# EasyEDA schematic 6coils-blue-v4.json
TITLE: Sheet_1; REV: 1.0; Date: 2024-01-02; Sheet: 1/1; Company: Your Company
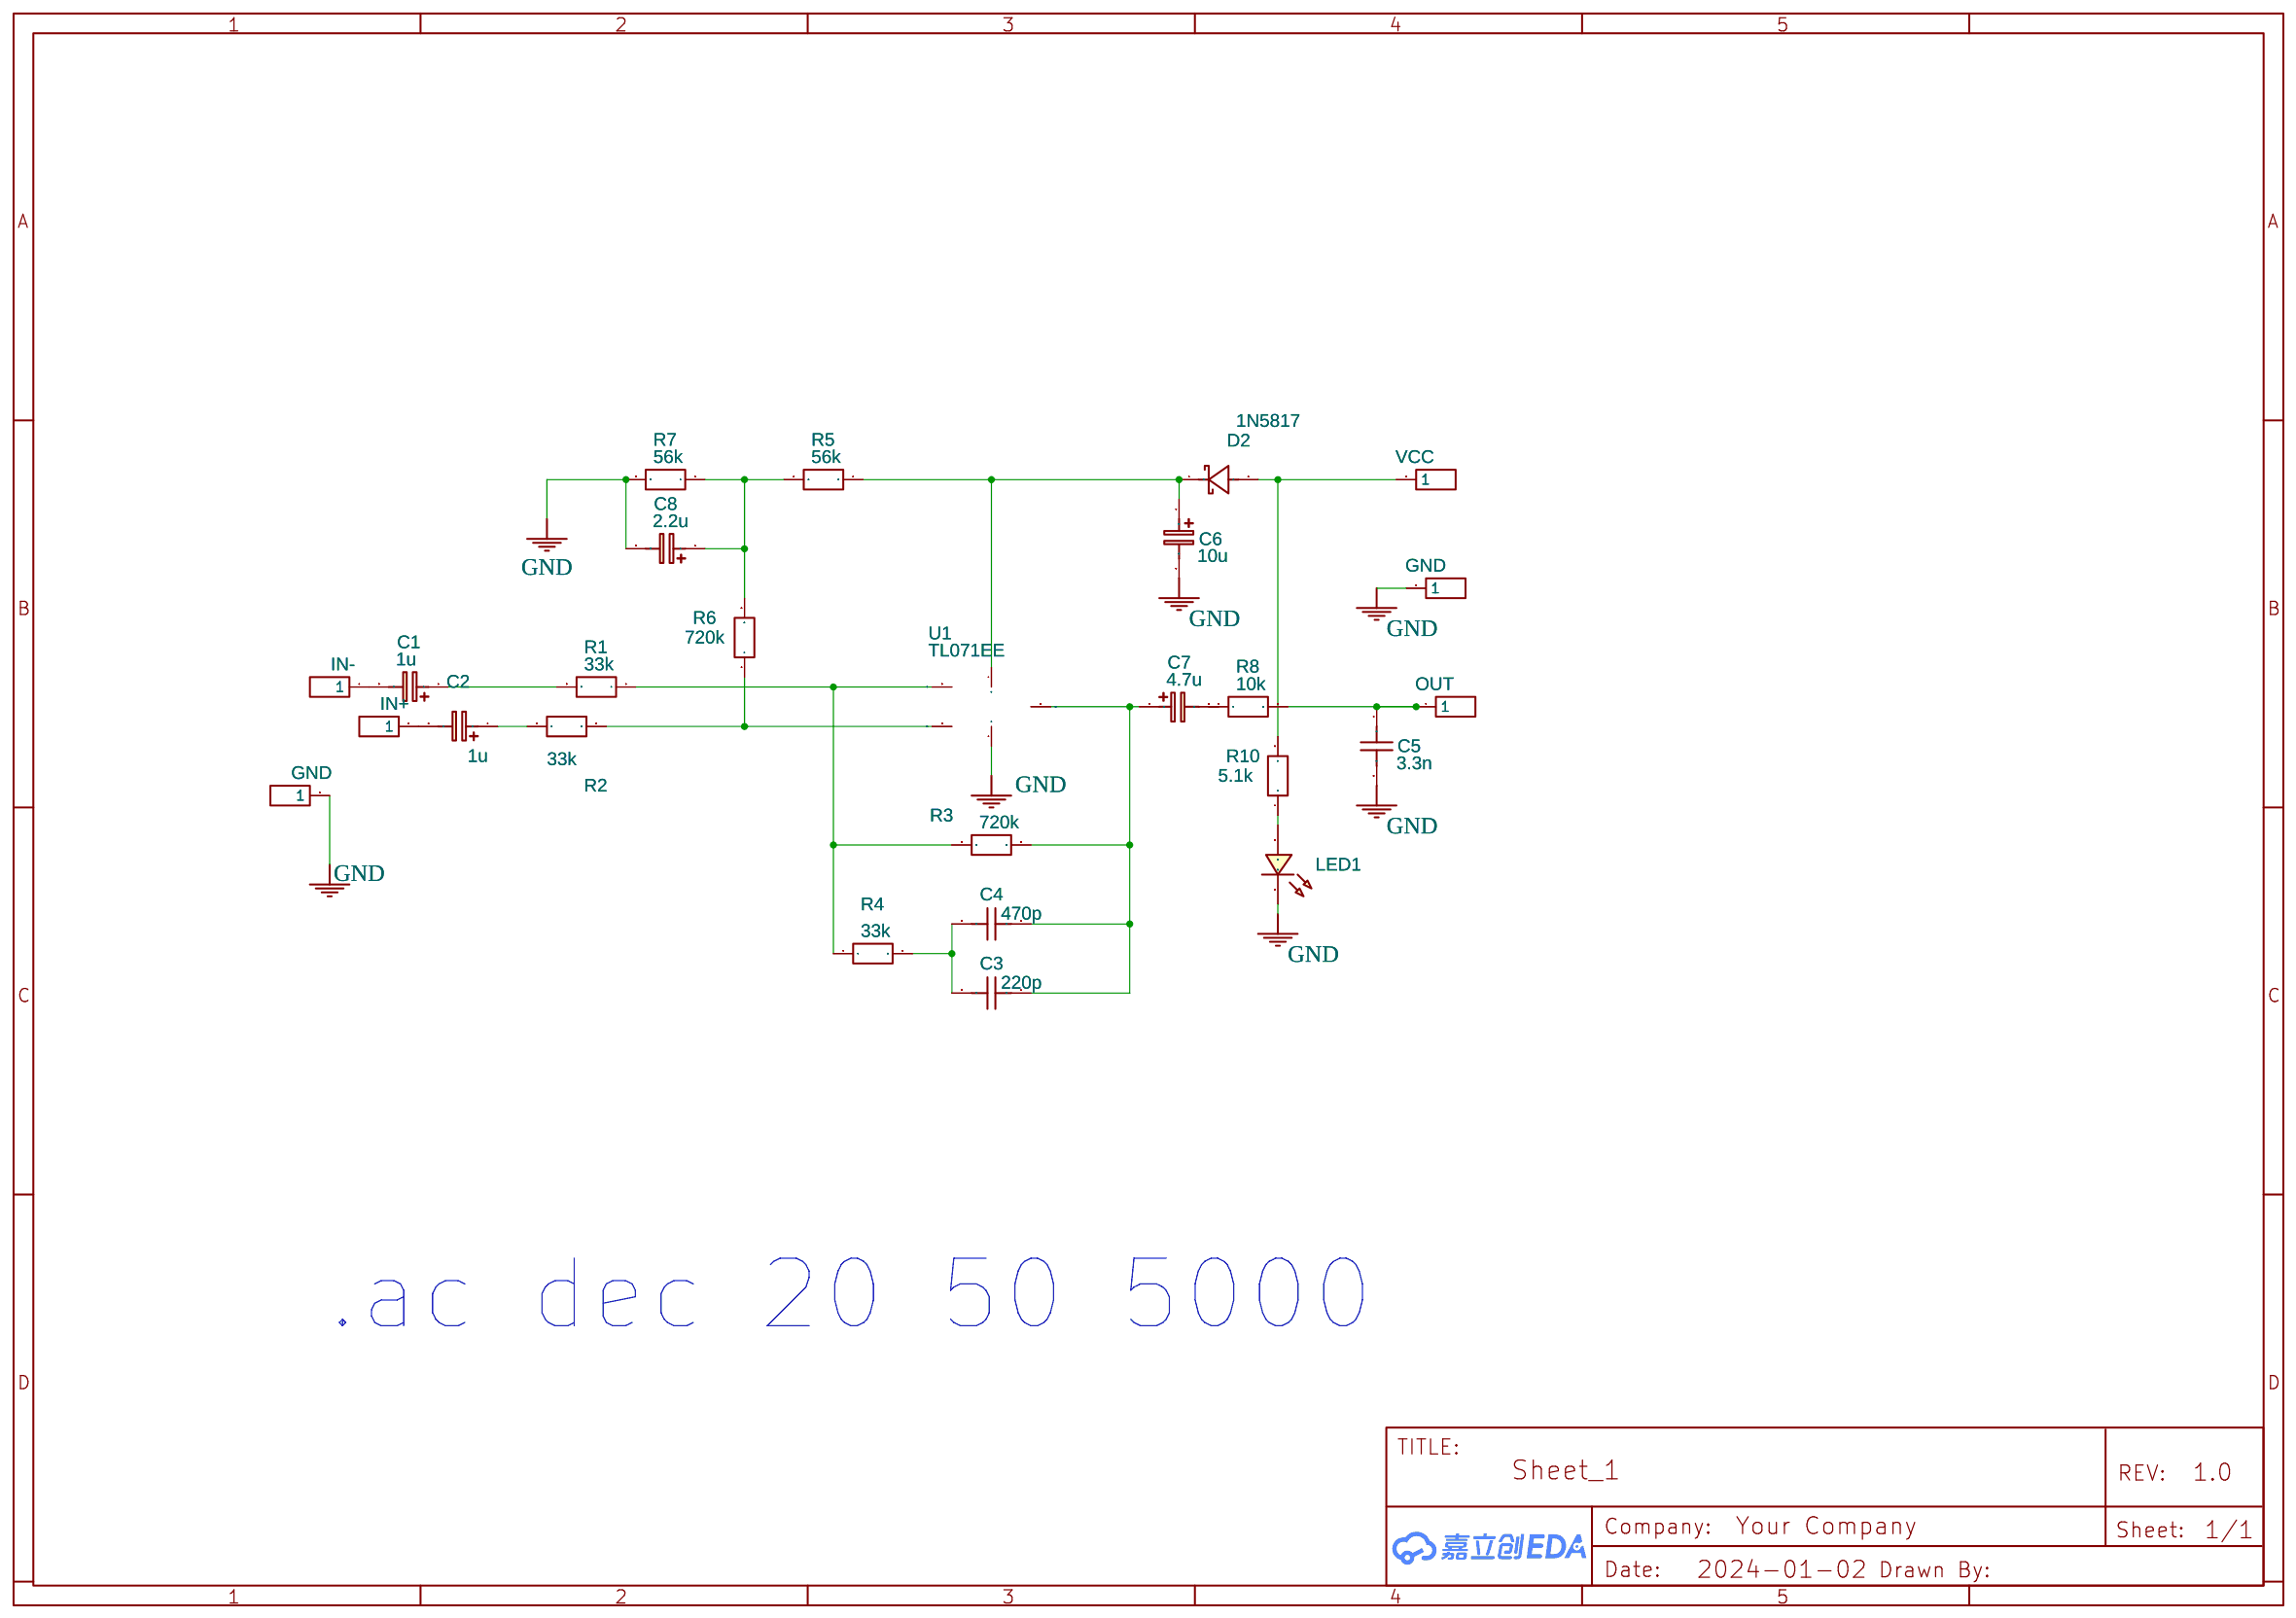
[diagram p0: schematic sheet]

## Parts
C1  1u  [CASE-A_3216]
C2  1u  [CASE-A_3216]
C3  220p  [CASE-A_3216]
C4  470p  [CASE-A_3216]
C5  3.3n  [CASE-A_3216]
C6  10u  [CASE-A_3216]
C7  4.7u  [CASE-A_3216]
C8  2.2u  [CASE-A_3216]
D2  1N5817  [D-FLAT_L4.3-W2.6-LS5.3-RD]
IGND1  IN-  [HDR-M-2.54_1X1]
IGND2  IN+  [HDR-M-2.54_1X1]
IGND3  GND  [HDR-M-2.54_1X1]
IGND4  VCC  [HDR-M-2.54_1X1]
IGND5  OUT  [HDR-M-2.54_1X1]
IGND6  GND  [HDR-M-2.54_1X1]
LED1  LED-TH-5mm_R  [LED1206-FD]
R1  33k  [R0603]
R2  33k  [R0603]
R3  720k  [R0603]
R4  33k  [R0603]
R5  56k  [R0603]
R6  720k  [R0603]
R7  56k  [R0603]
R8  10k  [R0603]
R10  5.1k  [R0603]
U1  TL071EE  [TL071]

## Library data of the parts
C1 C2 C6-C8 = C_Tan_SMD_A_EU: Contributor: LCEDA_Lib
C3-C5 = Capacitor_US: Contributor: EasyEDA; Supplier: YUJING; Capacitance: 1u
D2 = DSCHOTTKY: Contributor: LCSC; Supplier: LCSC; Supplier Part: C9900012836; Manufacturer: null; JLCPCB Part Class: Extended Part
IGND1-IGND6 = HDR-M-2.54_1x1: Supplier Part: C81276; Supplier: LCSC; Contributor: LCEDA_Lib
LED1 = LED-TH-5mm_R: Manufacturer: EVERLIGHT(台湾亿光); Manufacturer Part: 333-2SURD/S530-A3; Supplier Part: C87271; Supplier: LCSC; Contributor: LCEDA_Lib
R1-R8 R10 = R_0603_EU: Contributor: LCEDA_Lib
U1 = TL071EE: Contributor: andyfierman; sim: true

## Nets
GND: C5.2 C6.2 C8.2 IGND3.1 IGND6.1 LED1.2 R7.2 U1.4(V-)
Net-(C1-1): C1.1 R1.2
Net-(C1-2): C1.2 IGND1.1
Net-(C2-1): C2.1 R2.2
Net-(C2-2): C2.2 IGND2.1
Net-(C3-1): C3.1 C4.1 C7.1 R3.2 U1.6(OUT)
Net-(C3-2): C3.2 C4.2 R4.2
Net-(C5-1): C5.1 IGND5.1 R8.2
Net-(C6-1): C6.1 D2.1 R5.1 U1.7(V+)
Net-(C7-2): C7.2 R8.1
Net-(C8-1): C8.1 R5.2 R6.2 R7.1
Net-(D2-2): D2.2 IGND4.1 R10.2
Net-(LED1-1): LED1.1 R10.1
Net-(R1-1): R1.1 R3.1 R4.1 U1.2(IN-)
Net-(R2-1): R2.1 R6.1 U1.3(IN+)

## Notes on the sheet
- .ac dec 20 50 5000
